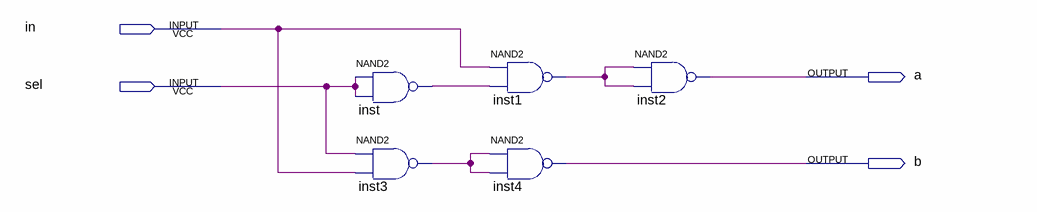
[diagram p0: schematic sheet]
// Quartus schematic DMux.bdf as structural Verilog: 5 symbols, 4 pins
module DMux (
  input  in,
  input  sel,
  output a,
  output b
);

  wire inst1_out, inst3_out, inst_out;

  nand inst (inst_out, sel, sel);
  nand inst3 (inst3_out, sel, in);
  nand inst1 (inst1_out, in, inst_out);
  nand inst4 (b, inst3_out, inst3_out);
  nand inst2 (a, inst1_out, inst1_out);
endmodule
